# EAGLE schematic BUS_OUT (EAGLE 9.6.2)
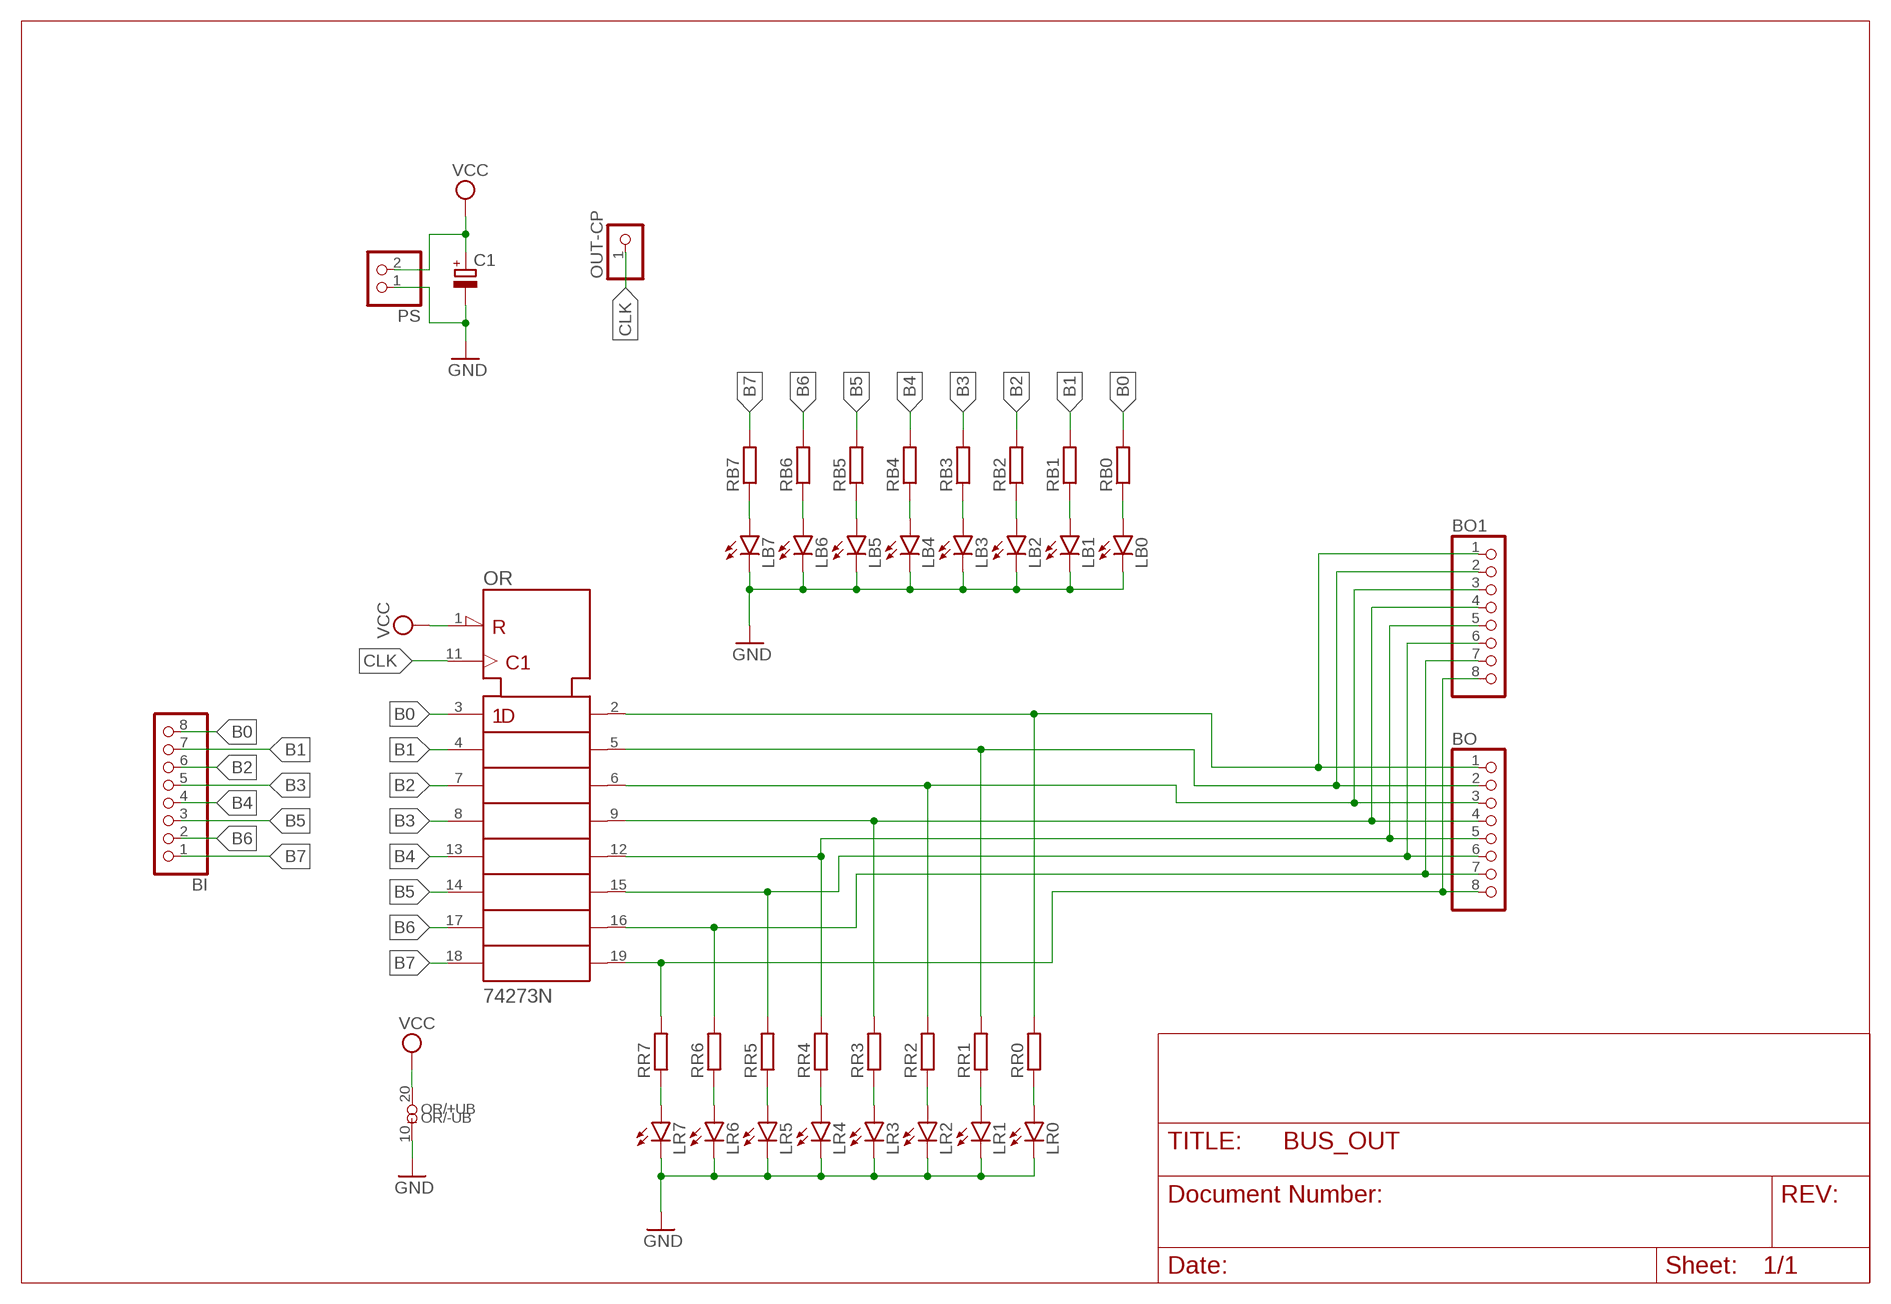
[diagram p0: schematic, sheet 1]

## Parts
BI  PINHD-1X8  [1X08]
BO  PINHD-1X8  [1X08]
BO1  PINHD-1X8  [1X08]
C1  CPOL-EUE2.5-6  [E2,5-6]
LB0  LED5MM  [LED5MM]
LB1  LED5MM  [LED5MM]
LB2  LED5MM  [LED5MM]
LB3  LED5MM  [LED5MM]
LB4  LED5MM  [LED5MM]
LB5  LED5MM  [LED5MM]
LB6  LED5MM  [LED5MM]
LB7  LED5MM  [LED5MM]
LR0  LED5MM  [LED5MM]
LR1  LED5MM  [LED5MM]
LR2  LED5MM  [LED5MM]
LR3  LED5MM  [LED5MM]
LR4  LED5MM  [LED5MM]
LR5  LED5MM  [LED5MM]
LR6  LED5MM  [LED5MM]
LR7  LED5MM  [LED5MM]
OR  74273N  [DIL20]
OUT-CP  PINHD-1X1  [1X01]
PS  PINHD-1X2  [1X02]
RB0  R-EU_0204/7  [0204/7]
RB1  R-EU_0204/7  [0204/7]
RB2  R-EU_0204/7  [0204/7]
RB3  R-EU_0204/7  [0204/7]
RB4  R-EU_0204/7  [0204/7]
RB5  R-EU_0204/7  [0204/7]
RB6  R-EU_0204/7  [0204/7]
RB7  R-EU_0204/7  [0204/7]
RR0  R-EU_0204/7  [0204/7]
RR1  R-EU_0204/7  [0204/7]
RR2  R-EU_0204/7  [0204/7]
RR3  R-EU_0204/7  [0204/7]
RR4  R-EU_0204/7  [0204/7]
RR5  R-EU_0204/7  [0204/7]
RR6  R-EU_0204/7  [0204/7]
RR7  R-EU_0204/7  [0204/7]

## Nets
B0: BI.8 OR.3(1D) RB0.2
B1: BI.7 OR.4(2D) RB1.2
B2: BI.6 OR.7(3D) RB2.2
B3: BI.5 OR.8(4D) RB3.2
B4: BI.4 OR.13(5D) RB4.2
B5: BI.3 OR.14(6D) RB5.2
B6: BI.2 OR.17(7D) RB6.2
B7: BI.1 OR.18(8D) RB7.2
CLK: OR.11(CLK) OUT-CP.1
GND: C1.- LB0.K(C) LB1.K(C) LB2.K(C) LB3.K(C) LB4.K(C) LB5.K(C) LB6.K(C) LB7.K(C) LR0.K(C) LR1.K(C) LR2.K(C) LR3.K(C) LR4.K(C) LR5.K(C) LR6.K(C) LR7.K(C) OR.10(-UB) PS.1
N$1: LB7.A RB7.1
N$3: LB6.A RB6.1
N$5: LB5.A RB5.1
N$7: LB4.A RB4.1
N$9: LR7.A RR7.1
N$10: LB3.A RB3.1
N$11: BO1.8 BO.8 OR.19(8Q) RR7.2
N$12: LR6.A RR6.1
N$14: BO1.7 BO.7 OR.16(7Q) RR6.2
N$15: LR5.A RR5.1
N$16: LB2.A RB2.1
N$17: BO1.6 BO.6 OR.15(6Q) RR5.2
N$18: LR4.A RR4.1
N$20: BO1.5 BO.5 OR.12(5Q) RR4.2
N$21: LR3.A RR3.1
N$22: LB1.A RB1.1
N$23: BO1.4 BO.4 OR.9(4Q) RR3.2
N$24: LR2.A RR2.1
N$26: BO1.3 BO.3 OR.6(3Q) RR2.2
N$27: LR1.A RR1.1
N$28: LB0.A RB0.1
N$29: BO1.2 BO.2 OR.5(2Q) RR1.2
N$30: LR0.A RR0.1
N$32: BO1.1 BO.1 OR.2(1Q) RR0.2
VCC: C1.+ OR.1(!CLR) OR.20(+UB) PS.2

## Library data of the parts
BI BO BO1 = pinhead:PINHD-1X8: PIN HEADER
C1 = rcl:CPOL-EU: POLARIZED CAPACITOR, European symbol; SPICEPREFIX: C
LB0 LB1-LB7 LR0 LR1-LR7 = led:LED: LED OSRAM: - CHIPLED LG R971, LG N971, LY N971, LG Q971, LY Q971, LO R971, LY R971 LH N974, LH R974 LS Q976, LO Q976, LY Q976 LO Q996 - Hyper CHIPLED LW Q18S LB Q993, LB Q99A, LB R99A - SideLED LS A670, LO A670, LY A670, LG A670, LP A670 LB A673, LV A673, LT A673, LW A673 LH A674 LY A675 LS A676, LA A676, LO A676, LY A676, LW A676 LS A679, LY A679, LG A679 - Hyper Micro SIDELED® LS Y876, LA Y876, LO Y876, LY Y876 LT Y87S - SmartLED LW L88C, LW L88S LB L89C, LB L89S, LG L890 LS L89K, LO L89K, LY L89K LS L896, LA L896, LO L896, LY L896 - TOPLED LS T670, LO T670, LY T670, LG T670, LP T670 LSG T670, LSP T670, LSY T670, LOP T670, LYG T670 LG T671, LOG T671, LSG T671 LB T673, LV T673, LT T673, LW T673 LH T674 LS T676, LA T676, LO T676, LY T676, LB T676, LH T676, LSB T676, LW T676 LB T67C, LV T67C, LT T67C, LS T67K, LO T67K, LY T67K, LW E67C LS E67B, LA E67B, LO E67B, LY E67B, LB E67C, LV E67C, LT E67C LW T67C LS T679, LY T679, LG T679 LS T770, LO T770, LY T770, LG T770, LP T770 LB T773, LV T773, LT T773, LW T773 LH T774 LS E675, LA E675, LY E675, LS T675 LS T776, LA T776, LO T776, LY T776, LB T776 LHGB T686 LT T68C, LB T68C - Hyper Mini TOPLED® LB M676 - Mini TOPLED Santana® LG M470 LS M47K, LO M47K, LY M47K Source: http://www.osram.convergy.de LUXEON: - LUMILED® LXK2-PW12-R00, LXK2-PW12-S00, LXK2-PW14-U00, LXK2-PW14-V00 LXK2-PM12-R00, LXK2-PM12-S00, LXK2-PM14-U00 LXK2-PE12-Q00, LXK2-PE12-R00, LXK2-PE12-S00, LXK2-PE14-T00, LXK2-PE14-U00 LXK2-PB12-K00, LXK2-PB12-L00, LXK2-PB12-M00, LXK2-PB14-N00, LXK2-PB14-P00, LXK2-PB14-Q00 LXK2-PR12-L00, LXK2-PR12-M00, LXK2-PR14-Q00, LXK2-PR14-R00 LXK2-PD12-Q00, LXK2-PD12-R00, LXK2-PD12-S00 LXK2-PH12-R00, LXK2-PH12-S00 LXK2-PL12-P00, LXK2-PL12-Q00, LXK2-PL12-R00 Source: www.luxeon.com KINGBRIGHT: KA-3528ASYC Source: www.kingbright.com
OR = 74ttl-din:74*273: Octal D type FLIP FLOP, clear
OUT-CP = pinhead:PINHD-1X1: PIN HEADER
PS = pinhead:PINHD-1X2: PIN HEADER
RB0 RB1-RB7 RR0 RR1-RR7 = rcl:R-EU_: RESISTOR, European symbol; SPICEPREFIX: R